# Altium schematic sheet Overview.SchDoc: Overview_USV_drive
size A4; Organization: Ernst-Abbe-Hochschule Jena; Address1: FB Maschinenbau; Address2: Carl-Zeiss-Promenade 2; Address3: 07745 Jena; Address4: Germany; DocumentNumber: 1; SheetNumber: 1; SheetTotal: 3
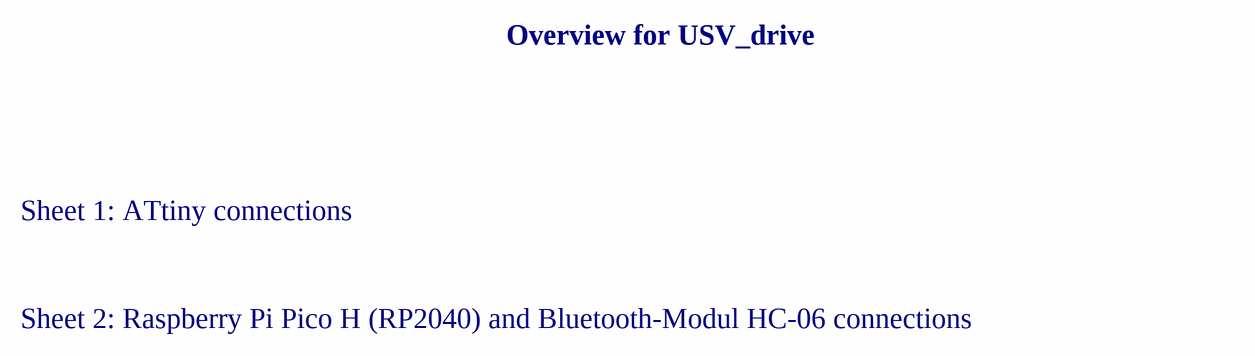
[diagram p0: Overview.SchDoc]

## Notes on the sheet
- Overview for USV_drive
- Sheet 1: ATtiny connections
- Sheet 2: Raspberry Pi Pico H (RP2040) and Bluetooth-Modul HC-06 connections
- Title
- Size:
- Date:
- A4
- Number:
- Time:
- Revision:
- Sheet
- of
- File: